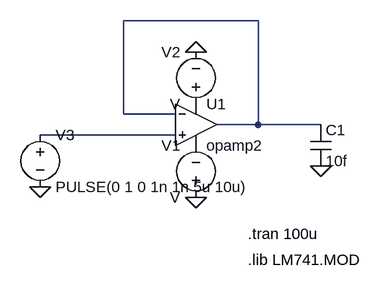
[diagram p0: schematic Draft3.asc]
Draft3.asc, the LTspice schematic file:
Version 4
SHEET 1 880 680
WIRE 304 0 96 0
WIRE 96 144 96 0
WIRE 176 144 96 144
WIRE 304 160 304 0
WIRE 304 160 240 160
WIRE 400 160 304 160
WIRE 176 176 -32 176
FLAG 208 272 0
FLAG 208 48 0
FLAG -32 256 0
FLAG 400 224 0
SYMBOL Opamps\\opamp2 208 96 R0
SYMATTR InstName U1
SYMBOL voltage 208 288 R180
WINDOW 0 24 96 Left 2
WINDOW 3 24 16 Left 2
SYMATTR InstName V1
SYMBOL voltage 208 144 R180
WINDOW 0 24 96 Left 2
WINDOW 3 24 16 Left 2
SYMATTR InstName V2
SYMBOL voltage -32 160 R0
WINDOW 123 24 124 Left 2
WINDOW 39 0 0 Left 0
SYMATTR InstName V3
SYMATTR Value PULSE(0 1 0 1n 1n 5u 10u)
SYMBOL cap 384 160 R0
SYMATTR InstName C1
SYMATTR Value 10f
TEXT 288 328 Left 2 !.tran 100u
TEXT 288 368 Left 2 !.lib LM741.MOD

The netlist it stands for:
* Draft3.asc
XU1 N002 N001 P001 P002 N001 opamp2  ; pins In+ In- V+ V- OUT
V1 0 P002 V
V2 P001 0 V
V3 N002 0 PULSE(0 1 0 1n 1n 5u 10u)
C1 N001 0 10f
.tran 100u
.lib LM741.MOD
.backanno
.end